# EAGLE design Zocalo340 (EAGLE 4.16)
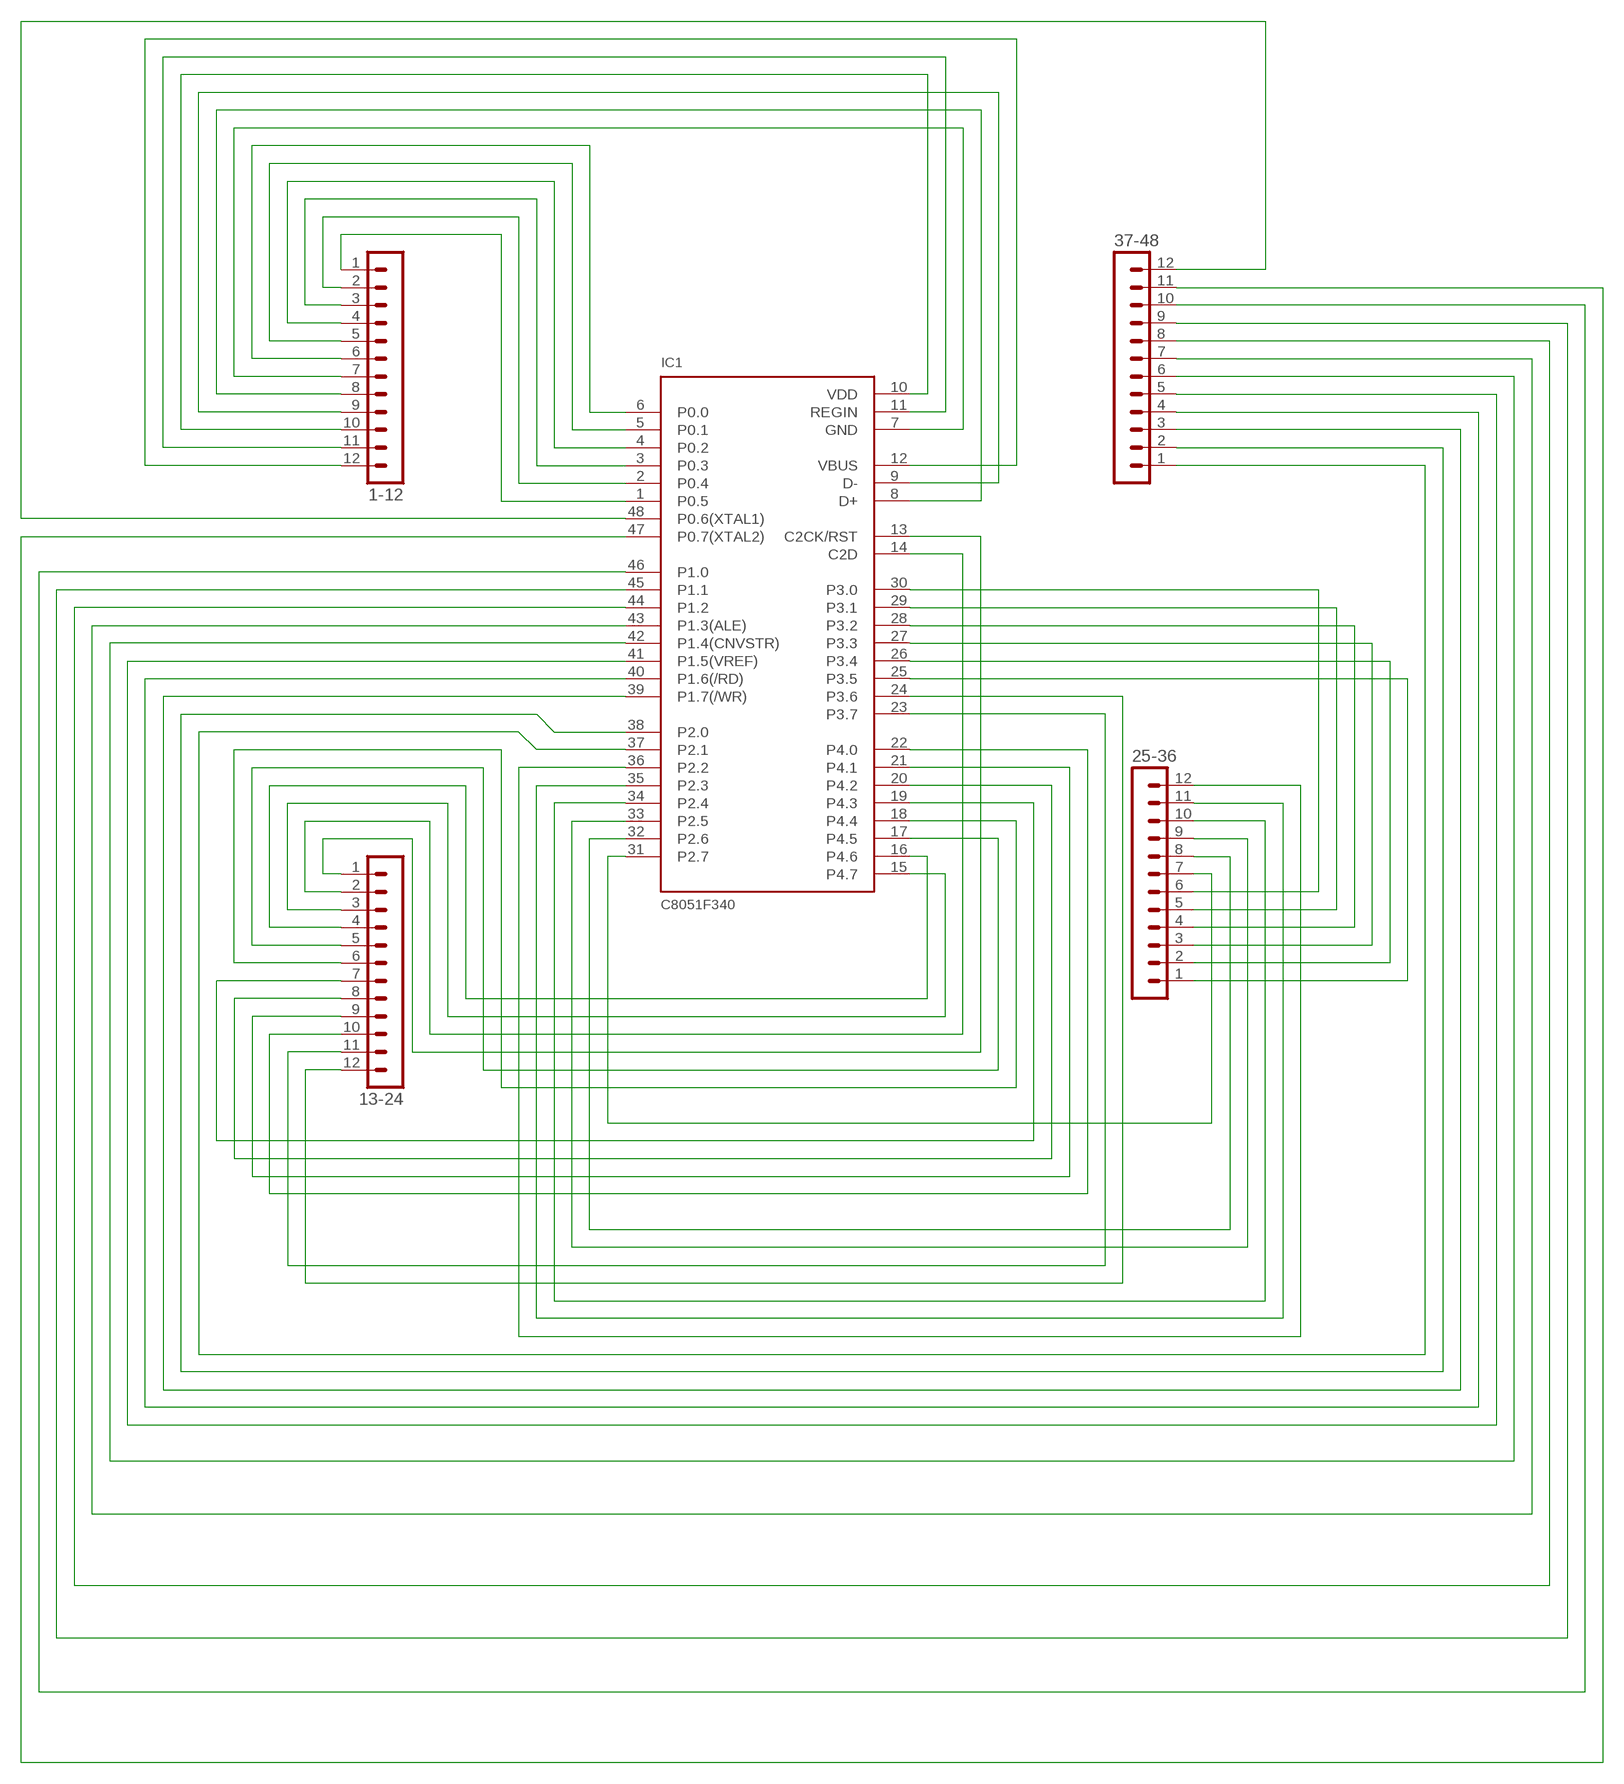
[diagram p0: schematic, sheet 1]

## Parts
1-12  MA12-1  [MA12-1]
13-24  MA12-1  [MA12-1]
25-36  MA12-1  [MA12-1]
37-48  MA12-1  [MA12-1]
IC1  C8051F340  [TQFP48]

## Nets
N$1: 1-12.1 IC1.1(P0.5)
N$2: 1-12.2 IC1.2(P0.4)
N$3: 1-12.3 IC1.3(P0.3)
N$4: 1-12.4 IC1.4(P0.2)
N$5: 1-12.5 IC1.5(P0.1)
N$6: 1-12.6 IC1.6(P0.0)
N$7: 1-12.7 IC1.7(GND)
N$8: 1-12.8 IC1.8(D+)
N$9: 1-12.9 IC1.9(D-)
N$10: 1-12.10 IC1.10(VDD)
N$11: 1-12.11 IC1.11(REGIN)
N$12: 1-12.12 IC1.12(VBUS)
N$13: 13-24.1 IC1.13(C2CK/RST)
N$14: 13-24.2 IC1.14(C2D)
N$15: 13-24.3 IC1.15(P4.7)
N$16: 13-24.4 IC1.16(P4.6)
N$17: 13-24.5 IC1.17(P4.5)
N$18: 13-24.6 IC1.18(P4.4)
N$19: 13-24.7 IC1.19(P4.3)
N$20: 13-24.8 IC1.20(P4.2)
N$21: 13-24.9 IC1.21(P4.1)
N$22: 13-24.10 IC1.22(P4.0)
N$23: 13-24.11 IC1.23(P3.7)
N$24: 13-24.12 IC1.24(P3.6)
N$25: 25-36.1 IC1.25(P3.5)
N$26: 25-36.2 IC1.26(P3.4)
N$27: 25-36.3 IC1.27(P3.3)
N$28: 25-36.4 IC1.28(P3.2)
N$29: 25-36.5 IC1.29(P3.1)
N$30: 25-36.6 IC1.30(P3.0)
N$31: 25-36.7 IC1.31(P2.7)
N$32: 25-36.8 IC1.32(P2.6)
N$33: 25-36.9 IC1.33(P2.5)
N$34: 25-36.10 IC1.34(P2.4)
N$35: 25-36.11 IC1.35(P2.3)
N$36: 25-36.12 IC1.36(P2.2)
N$37: 37-48.1 IC1.37(P2.1)
N$38: 37-48.2 IC1.38(P2.0)
N$39: 37-48.3 IC1.39(P1.7(/WR))
N$40: 37-48.4 IC1.40(P1.6(/RD))
N$41: 37-48.5 IC1.41(P1.5(VREF))
N$42: 37-48.6 IC1.42(P1.4(CNVSTR))
N$43: 37-48.7 IC1.43(P1.3(ALE))
N$44: 37-48.8 IC1.44(P1.2)
N$45: 37-48.9 IC1.45(P1.1)
N$46: 37-48.10 IC1.46(P1.0)
N$47: 37-48.11 IC1.47(P0.7(XTAL2))
N$48: 37-48.12 IC1.48(P0.6(XTAL1))

## Library data of the parts
1-12 13-24 25-36 37-48 = con-lstb:MA12-1: PIN HEADER
IC1 = silabs-2:C8051F340: Full Speed USB Flash MCU

## Board
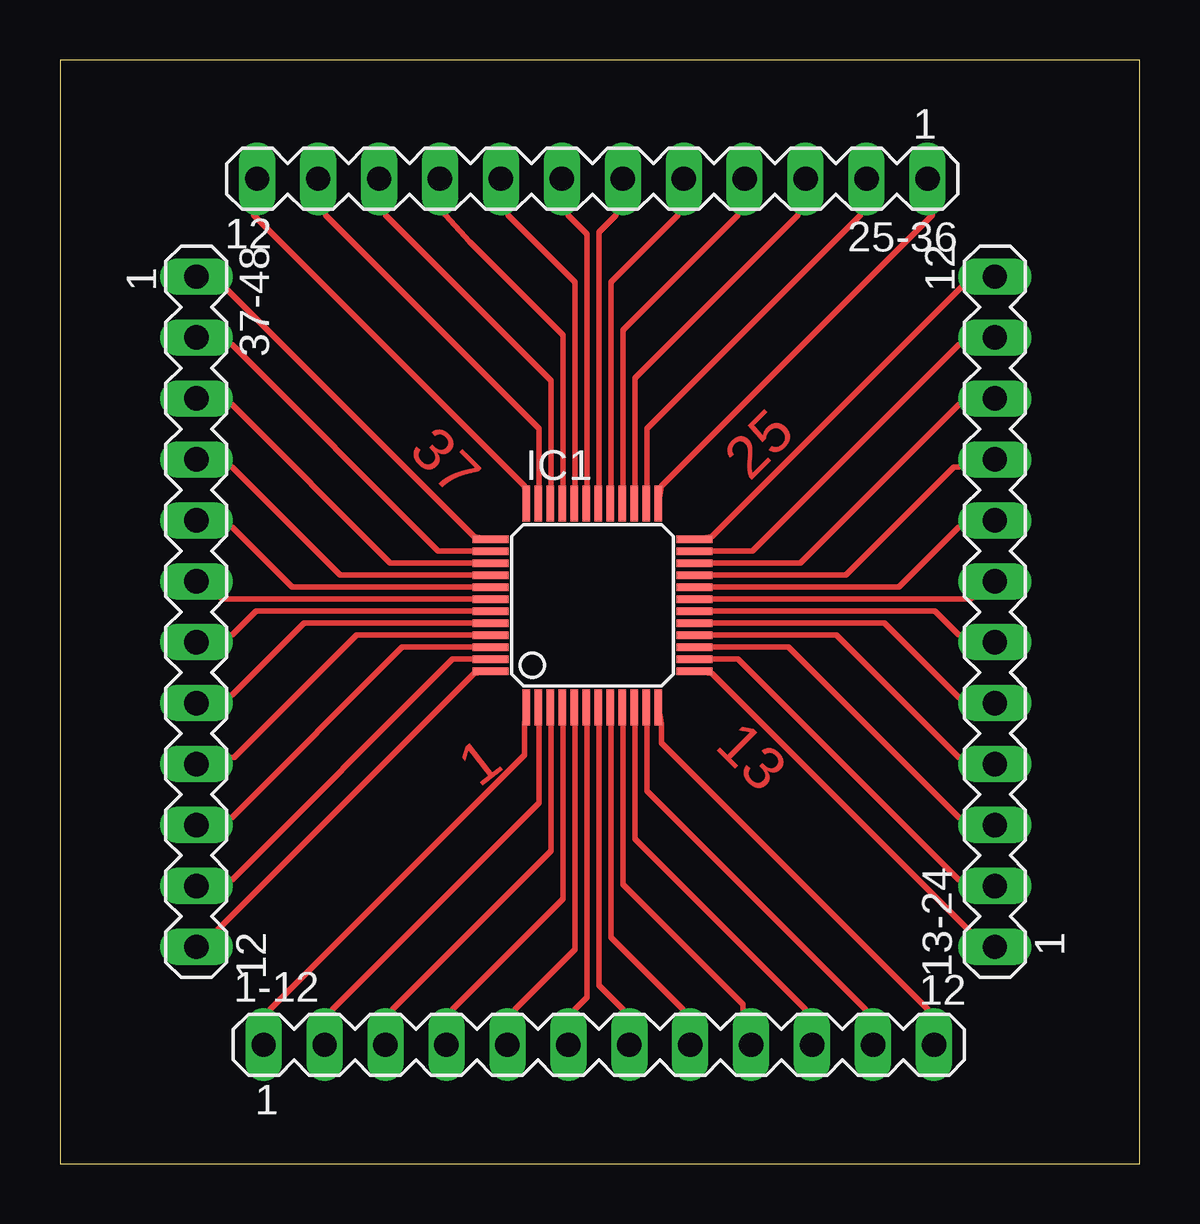
[diagram p1: board, top side]

Size 45 x 46 mm. Coordinates in mm from the lower left corner, seen from the top.
Outline: 0,0 45,0 45,46 0,46 0,0
Copper layers (1*16): Top 0.035mm / dielectric 1.5mm / Bottom 0.035mm
Design rules "default": minimum track width 9mil, minimum drill 24mil, track to track 1mil, track to pad 8mil, pad to pad 8mil, via to via 8mil, smd to smd 8mil, copper to edge 40mil, drill to drill 8mil, minimum pad ring 10mil, minimum via ring 8mil, stop-mask expansion 4mil, vias tented up to drill 0mil, thermal gap 10mil

### Footprints (pad centres in the part's own frame; a part is rotated, then mirrored left to right if it is on the bottom)
MA12-1 = drill 1.016 long: 1 -13.97,0; 2 -11.43,0; 3 -8.89,0; 4 -6.35,0; 5 -3.81,0; 6 -1.27,0; 7 1.27,0; 8 3.81,0; 9 6.35,0; 10 8.89,0; 11 11.43,0; 12 13.97,0
TQFP48 = smd 0.3 x 1.5: 1 -2.75,-4.25; 2 -2.25,-4.25; 3 -1.75,-4.25; 4 -1.25,-4.25; 5 -0.75,-4.25; 6 -0.25,-4.25; 7 0.25,-4.25; 8 0.75,-4.25; 9 1.25,-4.25; 10 1.75,-4.25; 11 2.25,-4.25; 12 2.75,-4.25; 25 2.75,4.25; 26 2.25,4.25; 27 1.75,4.25; 28 1.25,4.25; 29 0.75,4.25; 30 0.25,4.25; 31 -0.25,4.25; 32 -0.75,4.25; 33 -1.25,4.25; 34 -1.75,4.25; 35 -2.25,4.25; 36 -2.75,4.25 | smd 1.5 x 0.3: 13 4.25,-2.75; 14 4.25,-2.25; 15 4.25,-1.75; 16 4.25,-1.25; 17 4.25,-0.75; 18 4.25,-0.25; 19 4.25,0.25; 20 4.25,0.75; 21 4.25,1.25; 22 4.25,1.75; 23 4.25,2.25; 24 4.25,2.75; 37 -4.25,2.75; 38 -4.25,2.25; 39 -4.25,1.75; 40 -4.25,1.25; 41 -4.25,0.75; 42 -4.25,0.25; 43 -4.25,-0.25; 44 -4.25,-0.75; 45 -4.25,-1.25; 46 -4.25,-1.75; 47 -4.25,-2.25; 48 -4.25,-2.75

### Placement (x,y rotation side)
1-12  22.46,4.95 0 top
13-24  38.97,23 90 top
25-36  22.19,41.05 180 top
37-48  5.68,23 270 top
IC1  22.19,23.27 0 top

### Tracks (layer width: path | path; a pad name or v marks a point on that pad's centre or on a via)
N$1
  Top 0.229: IC1.1 19.37,18.33 19.37,17.03 8.77,6.43 1-12.1
N$2
  Top 0.229: IC1.2 19.97,18.33 19.97,15.03 11.37,6.43 1-12.2
N$3
  Top 0.229: IC1.3 20.47,18.33 20.47,13.03 13.87,6.43 1-12.3
N$4
  Top 0.229: IC1.4 20.97,18.33 20.97,11.03 16.37,6.43 1-12.4
N$5
  Top 0.229: IC1.5 21.47,18.33 21.47,8.93 18.97,6.43 1-12.5
N$6
  Top 0.229: IC1.6 21.97,18.33 21.97,6.93 21.47,6.43 1-12.6
N$7
  Top 0.229: IC1.7 22.47,18.33 22.47,7.43 23.47,6.43 1-12.7
N$8
  Top 0.229: IC1.8 22.97,18.33 22.97,9.43 25.97,6.43 1-12.8
N$9
  Top 0.229: IC1.9 23.47,18.33 23.47,11.63 28.47,6.63 28.47,6.43 1-12.9
N$10
  Top 0.229: IC1.10 23.97,18.33 23.97,13.53 31.07,6.43 1-12.10
N$11
  Top 0.229: IC1.11 24.47,18.33 24.47,15.53 33.57,6.43 1-12.11
N$12
  Top 0.229: IC1.12 25.07,18.33 25.07,17.53 36.17,6.43 1-12.12
N$13
  Top 0.229: IC1.13 27.17,20.43 37.87,9.73 13-24.1
N$14
  Top 0.229: IC1.14 27.17,21.03 28.27,21.03 37.47,11.83 13-24.2
N$15
  Top 0.229: IC1.15 27.17,21.53 30.37,21.53 37.47,14.43 13-24.3
N$16
  Top 0.229: IC1.16 27.17,22.03 32.37,22.03 37.47,16.93 13-24.4
N$17
  Top 0.229: IC1.17 27.17,22.53 34.37,22.53 37.47,19.43 13-24.5
N$18
  Top 0.229: IC1.18 27.17,23.03 36.47,23.03 37.47,22.03 13-24.6
N$19
  Top 0.229: IC1.19 27.17,23.53 37.97,23.53 13-24.7
N$20
  Top 0.229: IC1.20 27.17,24.03 34.97,24.03 37.47,26.53 13-24.8
N$21
  Top 0.229: IC1.21 27.17,24.53 32.77,24.53 37.27,29.03 37.47,29.03 13-24.9
N$22
  Top 0.229: IC1.22 27.17,25.03 30.87,25.03 37.47,31.63 13-24.10
N$23
  Top 0.229: IC1.23 27.17,25.53 28.87,25.53 37.47,34.13 13-24.11
N$24
  Top 0.229: IC1.24 27.17,26.13 37.67,36.63 13-24.12
N$25
  Top 0.229: IC1.25 25.07,28.23 36.37,39.53 25-36.1
N$26
  Top 0.229: IC1.26 24.47,28.23 24.47,30.63 33.37,39.53 25-36.2
N$27
  Top 0.229: IC1.27 23.97,28.23 23.97,32.73 30.77,39.53 25-36.3
N$28
  Top 0.229: IC1.28 23.47,28.23 23.47,34.73 28.27,39.53 25-36.4
N$29
  Top 0.229: IC1.29 22.97,28.23 22.97,36.73 25.77,39.53 25-36.5
N$30
  Top 0.229: IC1.30 22.47,28.23 22.47,38.83 23.17,39.53 25-36.6
N$31
  Top 0.229: IC1.31 21.97,28.23 21.97,38.73 21.17,39.53 25-36.7
N$32
  Top 0.229: IC1.32 21.47,28.23 21.47,36.73 18.67,39.53 25-36.8
N$33
  Top 0.229: IC1.33 20.97,28.23 20.97,34.53 17.07,38.43 16.07,39.53 25-36.9
N$34
  Top 0.229: IC1.34 20.47,28.23 20.47,32.63 13.57,39.53 25-36.10
N$35
  Top 0.229: IC1.35 19.97,28.23 19.97,30.63 11.07,39.53 25-36.11
N$36
  Top 0.229: IC1.36 19.37,28.23 8.07,39.53 25-36.12
N$37
  Top 0.229: IC1.37 17.27,26.13 6.97,36.43 37-48.1
N$38
  Top 0.229: IC1.38 17.27,25.53 15.77,25.53 7.17,34.13 37-48.2
N$39
  Top 0.229: IC1.39 17.27,25.03 13.77,25.03 7.17,31.63 37-48.3
N$40
  Top 0.229: IC1.40 17.27,24.53 11.67,24.53 7.17,29.03 37-48.4
N$41
  Top 0.229: IC1.41 17.27,24.03 9.67,24.03 7.17,26.53 37-48.5
N$42
  Top 0.229: IC1.42 17.27,23.53 6.77,23.53 37-48.6
N$43
  Top 0.229: IC1.43 17.27,23.03 8.17,23.03 7.17,22.03 37-48.7
N$44
  Top 0.229: IC1.44 17.27,22.53 10.17,22.53 7.17,19.53 37-48.8
N$45
  Top 0.229: IC1.45 17.27,22.03 12.37,22.03 7.27,16.93 7.17,16.93 37-48.9
N$46
  Top 0.229: IC1.46 17.27,21.53 14.27,21.53 7.17,14.43 37-48.10
N$47
  Top 0.229: IC1.47 17.27,21.03 16.37,21.03 7.17,11.83 37-48.11
N$48
  Top 0.229: IC1.48 17.27,20.43 6.57,9.73 37-48.12

### Text on the board
Top: 25 | 37 | 13 | 1